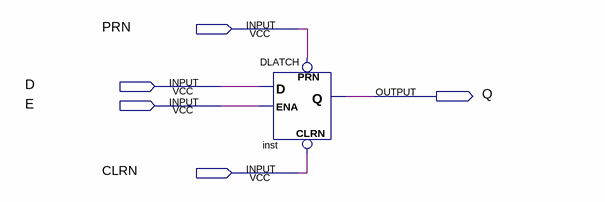
[diagram p0: schematic sheet]
// Quartus schematic Shameem_03132022_DLatch.bdf as structural Verilog: 1 symbols, 5 pins
module Shameem_03132022_DLatch (
  input  PRN,
  input  D,
  input  E,
  input  CLRN,
  output Q
);

  DLATCH inst (.CLRN(CLRN), .D(D), .ENA(E), .PRN(PRN), .Q(Q));
endmodule
